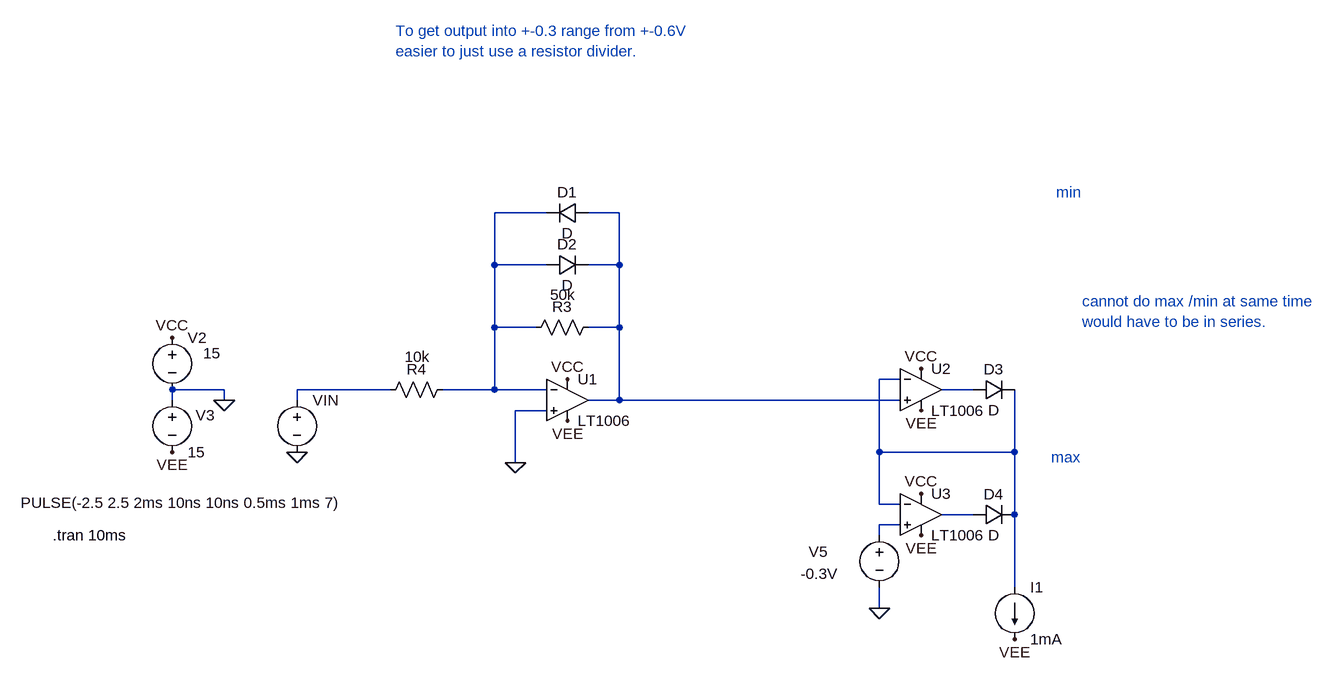
[diagram p0: schematic Draft03.asc]
Draft03.asc, the LTspice schematic file:
Version 4
SHEET 1 1904 680
WIRE 304 -192 224 -192
WIRE 416 -192 368 -192
WIRE 224 -112 224 -192
WIRE 304 -112 224 -112
WIRE 416 -112 416 -192
WIRE 416 -112 368 -112
WIRE 224 -16 224 -112
WIRE 288 -16 224 -16
WIRE 416 -16 416 -112
WIRE 416 -16 368 -16
WIRE 848 64 816 64
WIRE -192 80 -272 80
WIRE 64 80 -80 80
WIRE 224 80 224 -16
WIRE 224 80 144 80
WIRE 304 80 224 80
WIRE 960 80 912 80
WIRE -272 96 -272 80
WIRE -192 96 -192 80
WIRE -80 96 -80 80
WIRE 416 96 416 -16
WIRE 416 96 368 96
WIRE 848 96 416 96
WIRE 304 112 256 112
WIRE 816 176 816 64
WIRE 1024 176 1024 80
WIRE 1024 176 816 176
WIRE 256 192 256 112
WIRE 816 256 816 176
WIRE 848 256 816 256
WIRE 960 272 912 272
WIRE 1024 272 1024 176
WIRE 848 288 816 288
WIRE 816 304 816 288
WIRE 1024 384 1024 272
WIRE 816 416 816 384
FLAG -80 176 0
FLAG -192 96 0
FLAG -272 0 VCC
FLAG -272 176 VEE
FLAG 336 64 VCC
FLAG 336 128 VEE
FLAG 256 192 0
FLAG 880 48 VCC
FLAG 880 112 VEE
FLAG 880 240 VCC
FLAG 880 304 VEE
FLAG 816 416 0
FLAG 1024 464 VEE
SYMBOL voltage -80 80 R0
WINDOW 123 0 0 Left 0
WINDOW 39 0 0 Left 0
WINDOW 3 -425 174 Left 2
SYMATTR Value PULSE(-2.5 2.5 2ms 10ns 10ns 0.5ms 1ms 7)
SYMATTR InstName VIN
SYMBOL voltage -272 -16 R0
WINDOW 123 0 0 Left 0
WINDOW 39 0 0 Left 0
WINDOW 3 48 40 Left 2
SYMATTR Value 15
SYMATTR InstName V2
SYMBOL voltage -272 80 R0
WINDOW 123 0 0 Left 0
WINDOW 39 0 0 Left 0
WINDOW 0 36 39 Left 2
SYMATTR InstName V3
SYMATTR Value 15
SYMBOL OpAmps\\LT1006 336 32 R0
SYMATTR InstName U1
SYMBOL res 160 64 R90
WINDOW 0 0 56 VBottom 2
WINDOW 3 -50 55 VTop 2
SYMATTR InstName R4
SYMATTR Value 10k
SYMBOL OpAmps\\LT1006 880 16 R0
SYMATTR InstName U2
SYMBOL diode 368 -208 R90
WINDOW 0 0 32 VBottom 2
WINDOW 3 32 32 VTop 2
SYMATTR InstName D1
SYMBOL diode 304 -96 R270
WINDOW 0 32 32 VTop 2
WINDOW 3 0 32 VBottom 2
SYMATTR InstName D2
SYMBOL res 384 -32 R90
WINDOW 0 0 56 VBottom 2
WINDOW 3 -50 55 VTop 2
SYMATTR InstName R3
SYMATTR Value 50k
SYMBOL OpAmps\\LT1006 880 208 R0
SYMATTR InstName U3
SYMBOL diode 960 96 R270
WINDOW 0 32 32 VTop 2
WINDOW 3 0 32 VBottom 2
SYMATTR InstName D3
SYMBOL diode 960 288 R270
WINDOW 0 32 32 VTop 2
WINDOW 3 0 32 VBottom 2
SYMATTR InstName D4
SYMBOL voltage 816 288 R0
WINDOW 123 0 0 Left 0
WINDOW 39 0 0 Left 0
WINDOW 3 -121 75 Left 2
WINDOW 0 -109 41 Left 2
SYMATTR Value -0.3V
SYMATTR InstName V5
SYMBOL current 1024 384 R0
WINDOW 123 0 0 Left 0
WINDOW 39 0 0 Left 0
SYMATTR InstName I1
SYMATTR Value 1mA
TEXT -456 304 Left 2 !.tran 10ms
TEXT 72 -472 Left 2 ;To get output into +-0.3 range from +-0.6V\neasier to just use a resistor divider.
TEXT 1080 184 Left 2 ;max
TEXT 1088 -224 Left 2 ;min
TEXT 1128 -56 Left 2 ;cannot do max /min at same time\nwould have to be in series.

The netlist it stands for:
* Draft03.asc
VIN N004 0 PULSE(-2.5 2.5 2ms 10ns 10ns 0.5ms 1ms 7)
V2 VCC 0 15
V3 0 VEE 15
XU1 0 N001 VCC VEE N002 LT1006  ; pins In+ In- V+ V- OUT
R4 N001 N004 10k
XU2 N002 N003 VCC VEE N005 LT1006  ; pins In+ In- V+ V- OUT
D1 N002 N001 D
D2 N001 N002 D
R3 N002 N001 50k
XU3 N007 N003 VCC VEE N006 LT1006  ; pins In+ In- V+ V- OUT
D3 N005 N003 D
D4 N006 N003 D
V5 N007 0 -0.3V
I1 N003 VEE 1mA
.model D D
.lib standard.dio
.tran 10ms
* To get output into +-0.3 range from +-0.6V
* easier to just use a resistor divider.
* max
* min
* cannot do max /min at same time
* would have to be in series.
.lib LTC.lib
.backanno
.end